# EAGLE design Seaquencer (EAGLE 7.2.0)
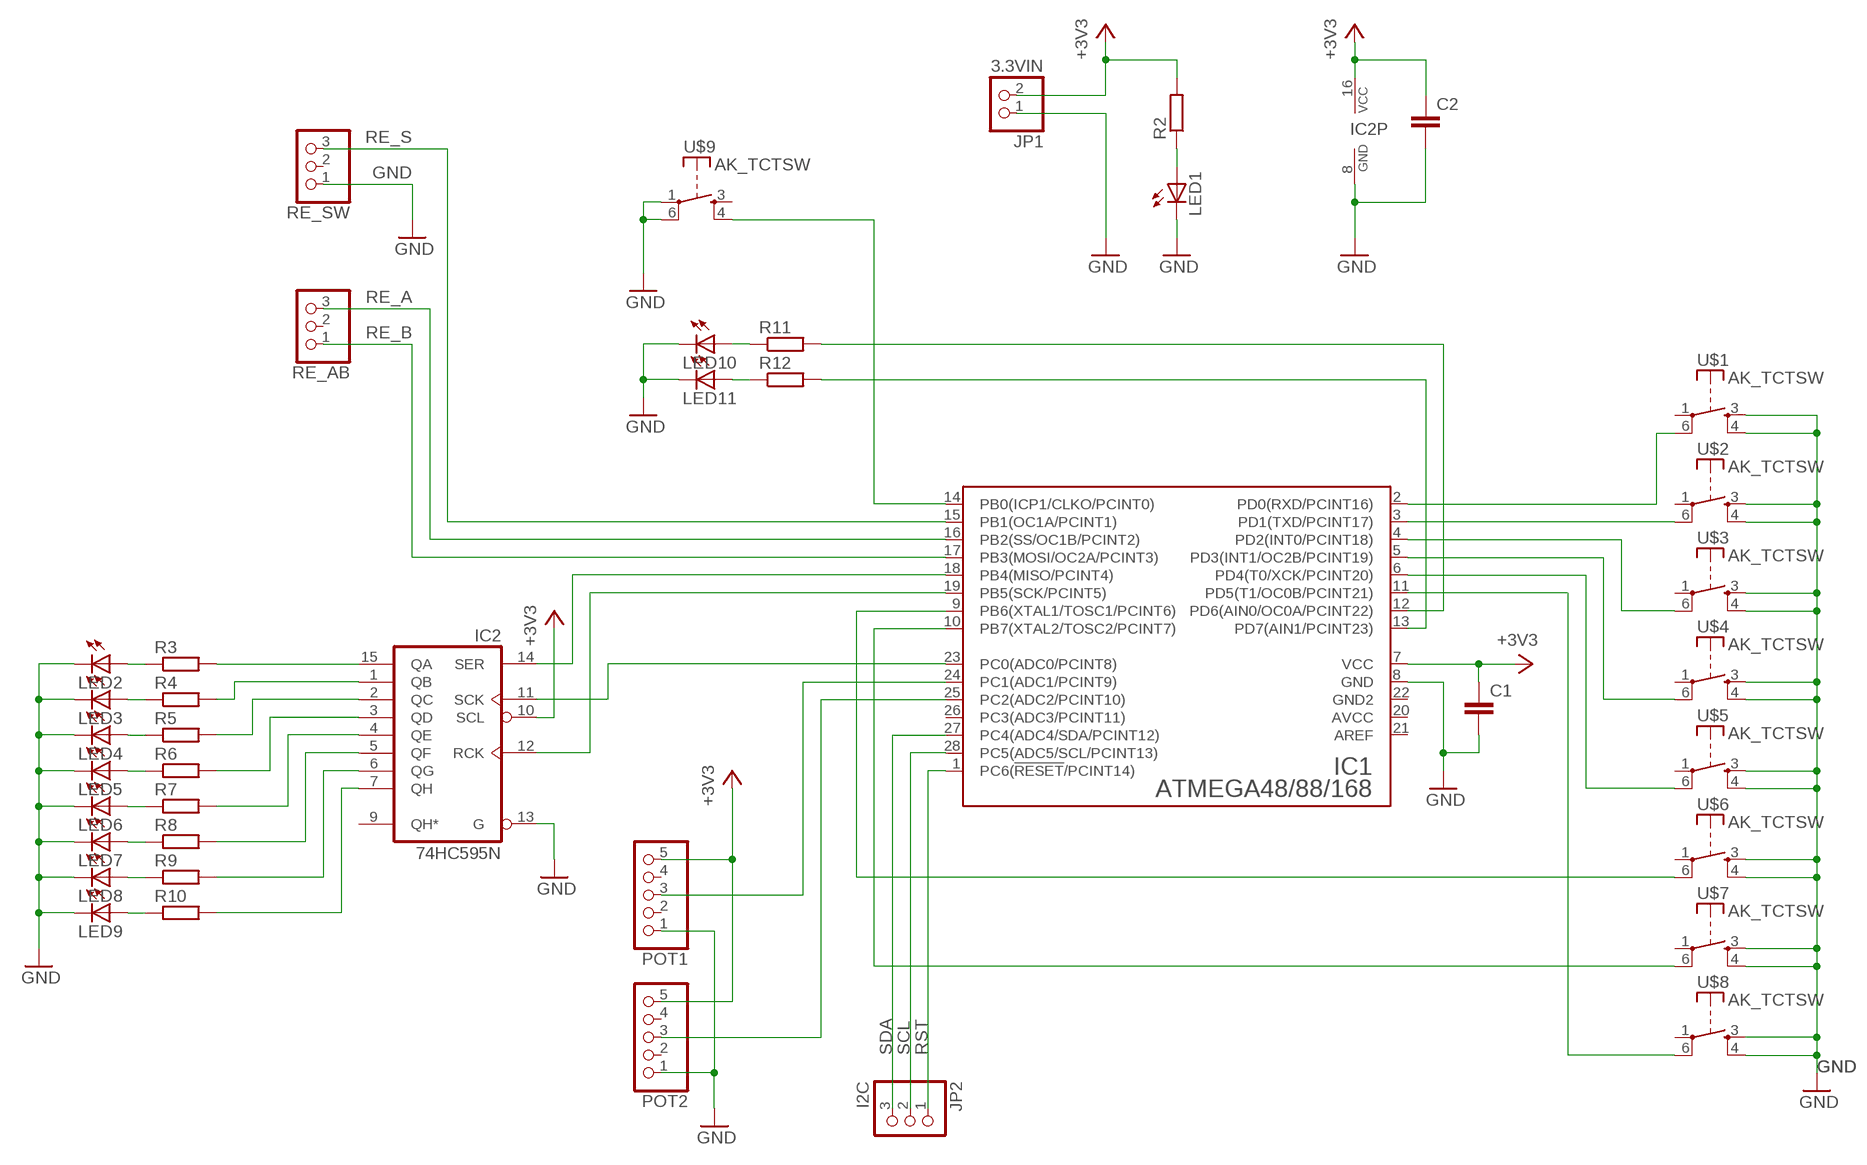
[diagram p0: schematic, sheet 1]

## Parts
C1  C-EU025-024X044  [C025-024X044]
C2  C-EU025-024X044  [C025-024X044]
IC1  ATMEGA48/88/168  [DIL28-3]
IC2  74HC595N  [DIL16]
JP1  3.3VIN  PINHD-1X2  [1X02]
JP2  I2C  PINHD-1X3  [1X03]
LED1  LED3MM  [LED3MM]
LED2  LED3MM  [LED3MM]
LED3  LED3MM  [LED3MM]
LED4  LED3MM  [LED3MM]
LED5  LED3MM  [LED3MM]
LED6  LED3MM  [LED3MM]
LED7  LED3MM  [LED3MM]
LED8  LED3MM  [LED3MM]
LED9  LED3MM  [LED3MM]
LED10  LED3MM  [LED3MM]
LED11  LED3MM  [LED3MM]
POT1  PINHD-1X5  [1X05]
POT2  PINHD-1X5  [1X05]
R2  R-EU_0207/7  [0207/7]
R3  R-EU_0207/7  [0207/7]
R4  R-EU_0207/7  [0207/7]
R5  R-EU_0207/7  [0207/7]
R6  R-EU_0207/7  [0207/7]
R7  R-EU_0207/7  [0207/7]
R8  R-EU_0207/7  [0207/7]
R9  R-EU_0207/7  [0207/7]
R10  R-EU_0207/7  [0207/7]
R11  R-EU_0207/7  [0207/7]
R12  R-EU_0207/7  [0207/7]
RE_AB  PINHD-1X3  [1X03]
RE_SW  PINHD-1X3  [1X03]
U$1  AK_TCTSW  [TME1]
U$2  AK_TCTSW  [TME1]
U$3  AK_TCTSW  [TME1]
U$4  AK_TCTSW  [TME1]
U$5  AK_TCTSW  [TME1]
U$6  AK_TCTSW  [TME1]
U$7  AK_TCTSW  [TME1]
U$8  AK_TCTSW  [TME1]
U$9  AK_TCTSW  [TME1]

## Nets
+3V3: C1.1 C2.1 IC1.7(VCC) IC2.10(SCL) IC2.16(VCC) JP1.2 POT1.5 POT2.5 R2.2
GND: C1.2 C2.2 IC1.8(GND) IC2.8(GND) IC2.13(G) JP1.1 LED1.K(C) LED2.K(C) LED3.K(C) LED4.K(C) LED5.K(C) LED6.K(C) LED7.K(C) LED8.K(C) LED9.K(C) LED10.K(C) LED11.K(C) POT1.1 POT2.1 RE_SW.1 U$1.3(S) U$1.4(S) U$2.3(S) U$2.4(S) U$3.3(S) U$3.4(S) U$4.3(S) U$4.4(S) U$5.3(S) U$5.4(S) U$6.3(S) U$6.4(S) U$7.3(S) U$7.4(S) U$8.3(S) U$8.4(S) U$9.1(P) U$9.6(P)
N$1: IC1.2(PD0(RXD/PCINT16)) U$1.6(P)
N$2: IC1.3(PD1(TXD/PCINT17)) U$2.6(P)
N$3: IC1.11(PD5(T1/OC0B/PCINT21)) U$8.6(P)
N$4: IC1.10(PB7(XTAL2/TOSC2/PCINT7)) U$7.6(P)
N$5: IC1.9(PB6(XTAL1/TOSC1/PCINT6)) U$6.6(P)
N$6: IC1.6(PD4(T0/XCK/PCINT20)) U$5.6(P)
N$7: IC1.5(PD3(INT1/OC2B/PCINT19)) U$4.6(P)
N$8: IC1.18(PB4(MISO/PCINT4)) IC2.14(SER)
N$9: IC1.23(PC0(ADC0/PCINT8)) IC2.11(SCK)
N$10: IC1.24(PC1(ADC1/PCINT9)) POT1.3
N$11: IC1.25(PC2(ADC2/PCINT10)) POT2.3
N$12: IC1.19(PB5(SCK/PCINT5)) IC2.12(RCK)
N$13: IC1.14(PB0(ICP1/CLKO/PCINT0)) U$9.4(S)
N$15: LED1.A R2.1
N$16: IC2.15(QA) R3.2
N$17: IC2.1(QB) R4.2
N$18: IC2.2(QC) R5.2
N$19: IC2.3(QD) R6.2
N$20: IC2.4(QE) R7.2
N$21: IC2.5(QF) R8.2
N$22: IC2.6(QG) R9.2
N$23: IC2.7(QH) R10.2
N$24: LED2.A R3.1
N$25: LED3.A R4.1
N$26: LED4.A R5.1
N$27: LED5.A R6.1
N$28: LED6.A R7.1
N$29: LED7.A R8.1
N$30: LED8.A R9.1
N$31: LED9.A R10.1
N$33: LED11.A R12.1
N$34: LED10.A R11.1
N$35: IC1.13(PD7(AIN1/PCINT23)) R12.2
N$36: IC1.12(PD6(AIN0/OC0A/PCINT22)) R11.2
N$41: IC1.4(PD2(INT0/PCINT18)) U$3.6(P)
RE_A: IC1.16(PB2(SS/OC1B/PCINT2)) RE_AB.3
RE_B: IC1.17(PB3(MOSI/OC2A/PCINT3)) RE_AB.1
RE_S: IC1.15(PB1(OC1A/PCINT1)) RE_SW.3
RST: IC1.1(PC6(!RESET!/PCINT14)) JP2.1
SCL: IC1.28(PC5(ADC5/SCL/PCINT13)) JP2.2
SDA: IC1.27(PC4(ADC4/SDA/PCINT12)) JP2.3
Unconnected: IC1.21(AREF) IC1.26(PC3(ADC3/PCINT11)) IC2.9(QH*) POT1.2 POT1.4 POT2.2 POT2.4 RE_AB.2 RE_SW.2 U$1.1(P) U$2.1(P) U$3.1(P) U$4.1(P) U$5.1(P) U$6.1(P) U$7.1(P) U$8.1(P) U$9.3(S)

## Power pins joined to a net without a drawn wire
AVCC: IC1.20(AVCC)
GND2: IC1.22(GND2)

## Library data of the parts
C1 C2 = rcl:C-EU: CAPACITOR, European symbol
IC1 = mylib:ATMEGA48/88/168
IC2 = 74xx-eu:74*595: 8-bit SHIFT REGISTER, output latch
JP1 = pinhead:PINHD-1X2: PIN HEADER
JP2 RE_AB RE_SW = pinhead:PINHD-1X3: PIN HEADER
LED1-LED11 = led:LED: LED OSRAM: - CHIPLED LG R971, LG N971, LY N971, LG Q971, LY Q971, LO R971, LY R971 LH N974, LH R974 LS Q976, LO Q976, LY Q976 LO Q996 - Hyper CHIPLED LW Q18S LB Q993, LB Q99A, LB R99A - SideLED LS A670, LO A670, LY A670, LG A670, LP A670 LB A673, LV A673, LT A673, LW A673 LH A674 LY A675 LS A676, LA A676, LO A676, LY A676, LW A676 LS A679, LY A679, LG A679 - Hyper Micro SIDELED® LS Y876, LA Y876, LO Y876, LY Y876 LT Y87S - SmartLED LW L88C, LW L88S LB L89C, LB L89S, LG L890 LS L89K, LO L89K, LY L89K LS L896, LA L896, LO L896, LY L896 - TOPLED LS T670, LO T670, LY T670, LG T670, LP T670 LSG T670, LSP T670, LSY T670, LOP T670, LYG T670 LG T671, LOG T671, LSG T671 LB T673, LV T673, LT T673, LW T673 LH T674 LS T676, LA T676, LO T676, LY T676, LB T676, LH T676, LSB T676, LW T676 LB T67C, LV T67C, LT T67C, LS T67K, LO T67K, LY T67K, LW E67C LS E67B, LA E67B, LO E67B, LY E67B, LB E67C, LV E67C, LT E67C LW T67C LS T679, LY T679, LG T679 LS T770, LO T770, LY T770, LG T770, LP T770 LB T773, LV T773, LT T773, LW T773 LH T774 LS E675, LA E675, LY E675, LS T675 LS T776, LA T776, LO T776, LY T776, LB T776 LHGB T686 LT T68C, LB T68C - Hyper Mini TOPLED® LB M676 - Mini TOPLED Santana® LG M470 LS M47K, LO M47K, LY M47K Source: http://www.osram.convergy.de LUXEON: - LUMILED® LXK2-PW12-R00, LXK2-PW12-S00, LXK2-PW14-U00, LXK2-PW14-V00 LXK2-PM12-R00, LXK2-PM12-S00, LXK2-PM14-U00 LXK2-PE12-Q00, LXK2-PE12-R00, LXK2-PE12-S00, LXK2-PE14-T00, LXK2-PE14-U00 LXK2-PB12-K00, LXK2-PB12-L00, LXK2-PB12-M00, LXK2-PB14-N00, LXK2-PB14-P00, LXK2-PB14-Q00 LXK2-PR12-L00, LXK2-PR12-M00, LXK2-PR14-Q00, LXK2-PR14-R00 LXK2-PD12-Q00, LXK2-PD12-R00, LXK2-PD12-S00 LXK2-PH12-R00, LXK2-PH12-S00 LXK2-PL12-P00, LXK2-PL12-Q00, LXK2-PL12-R00 Source: www.luxeon.com KINGBRIGHT: KA-3528ASYC Source: www.kingbright.com
POT1 POT2 = pinhead:PINHD-1X5: PIN HEADER
R2-R12 = rcl:R-EU_: RESISTOR, European symbol
U$1-U$9 = mylib:AK_TCTSW

## Board
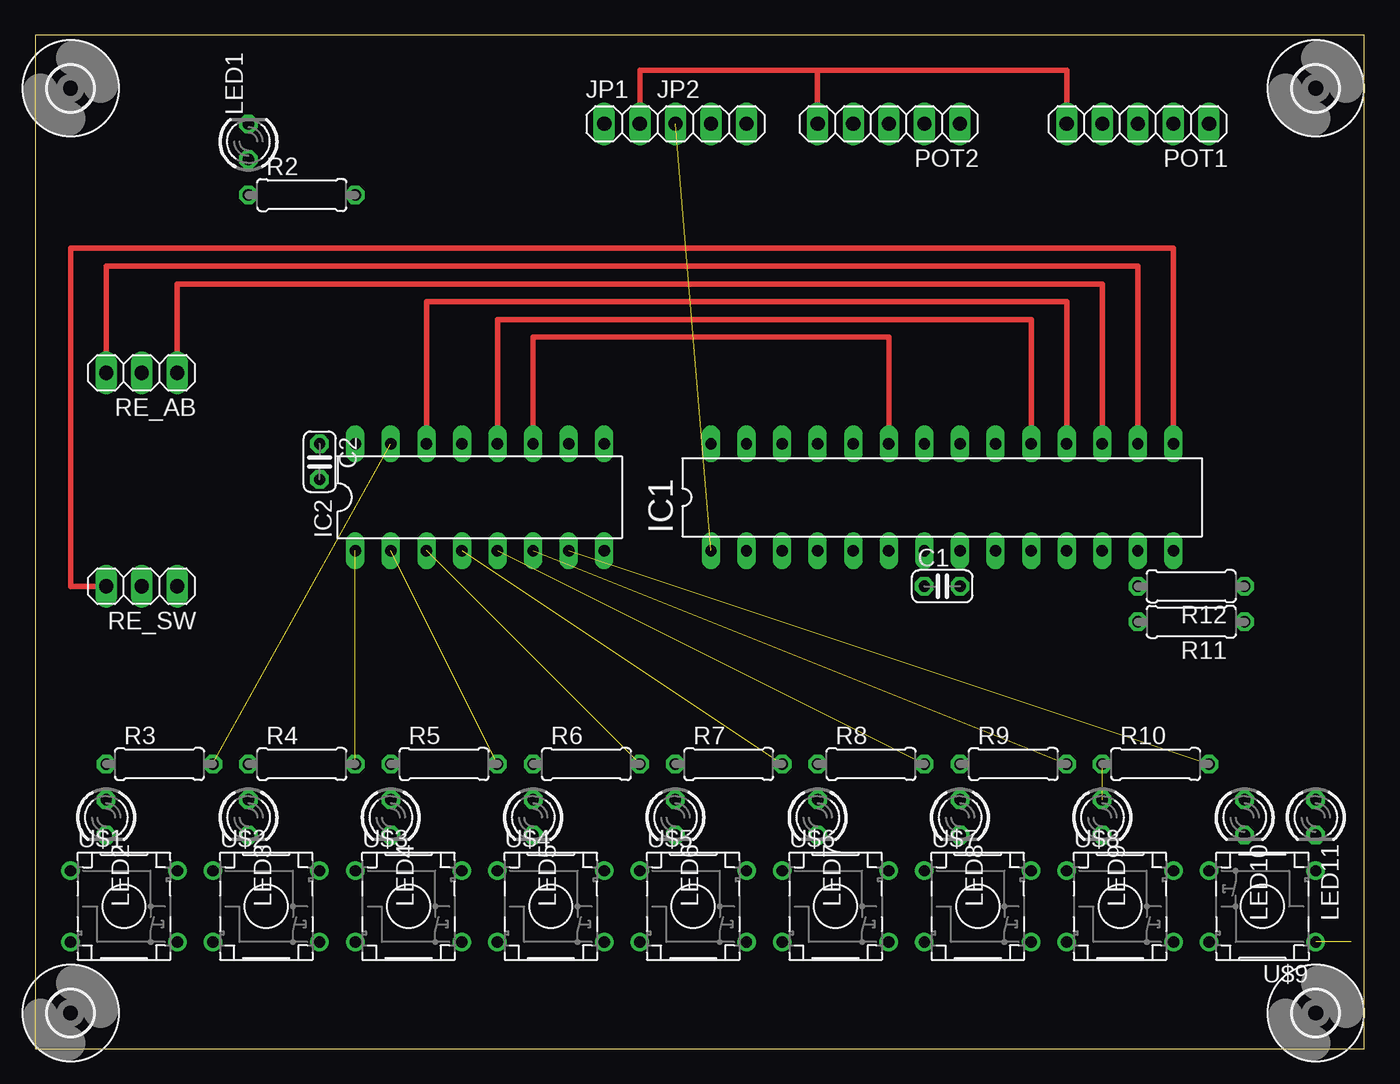
[diagram p1: board, top side]
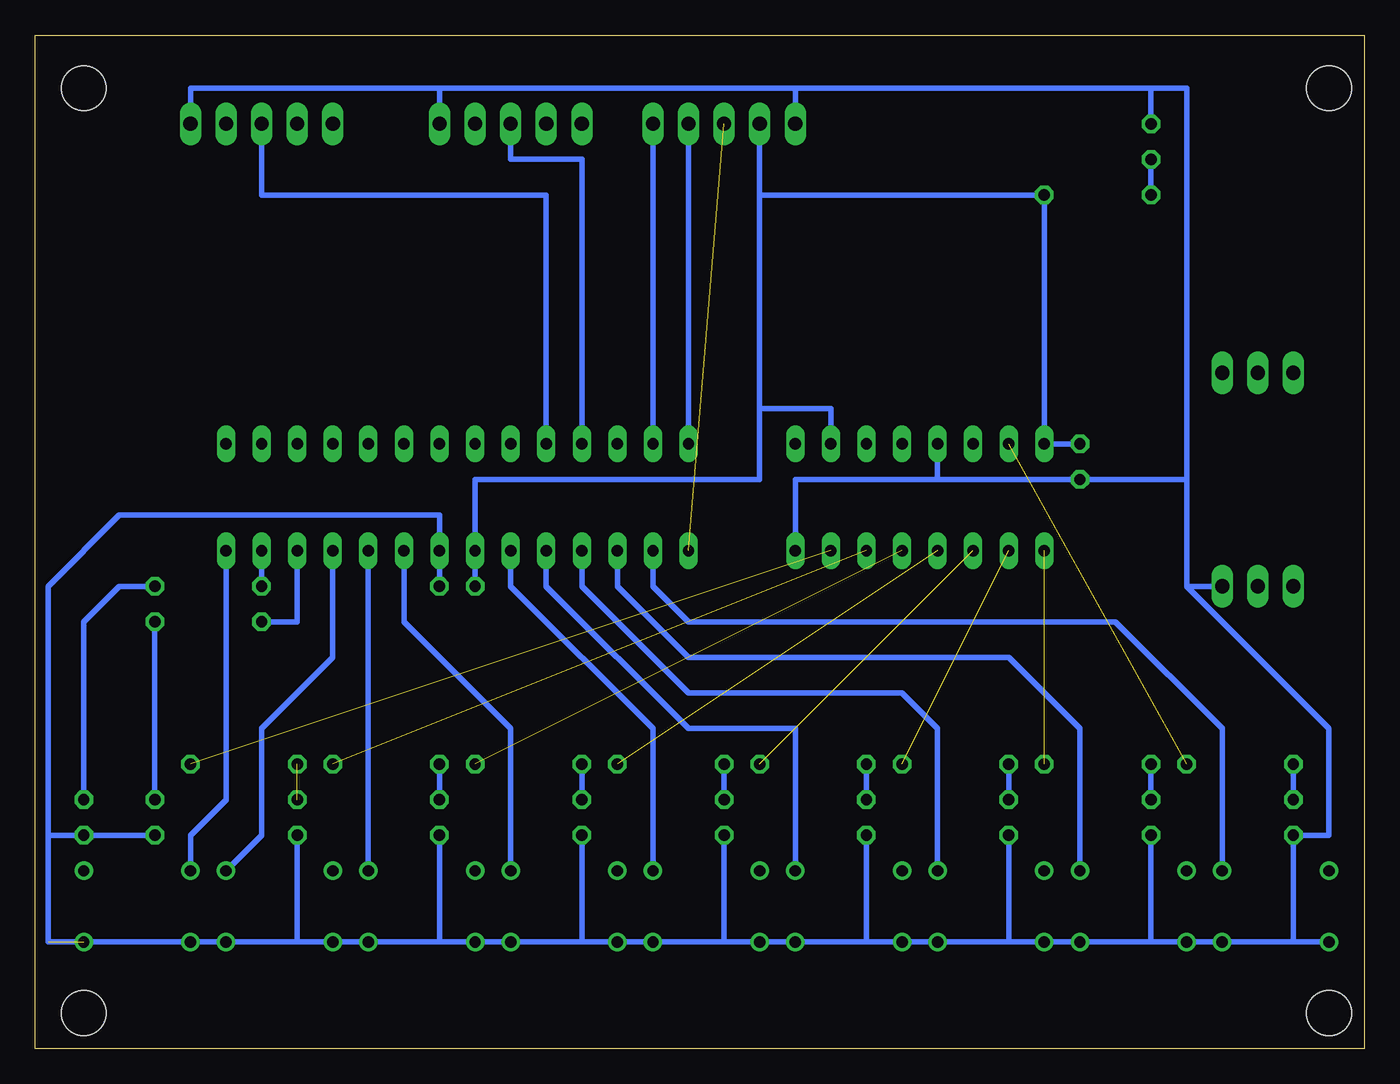
[diagram p2: board, bottom side, seen from below]

Size 94.92 x 72.38 mm. Coordinates in mm from the lower left corner, seen from the top.
Outline: 0,0 94.92,0 94.92,72.38 0,72.38 0,0
Copper layers (1*16): Top 0.035mm / dielectric 1.5mm / Bottom 0.035mm
Design rules "default": minimum track width 10mil, minimum drill 24mil, track to track 8mil, track to pad 8mil, pad to pad 8mil, via to via 8mil, smd to smd 8mil, copper to edge 40mil, drill to drill 8mil, minimum pad ring 10mil, minimum via ring 8mil, stop-mask expansion 4mil, vias tented up to drill 0mil, thermal gap 10mil

### Footprints (pad centres in the part's own frame; a part is rotated, then mirrored left to right if it is on the bottom)
C025-024X044 = drill 0.813 octagon: 1 -1.27,0; 2 1.27,0
DIL28-3 = drill 0.813 long: 1 -15.24,-3.81; 2 -12.7,-3.81; 3 -10.16,-3.81; 4 -7.62,-3.81; 5 -5.08,-3.81; 6 -2.54,-3.81; 7 0,-3.81; 8 2.54,-3.81; 9 5.08,-3.81; 10 7.62,-3.81; 11 10.16,-3.81; 12 12.7,-3.81; 13 15.24,-3.81; 14 17.78,-3.81; 15 17.78,3.81; 16 15.24,3.81; 17 12.7,3.81; 18 10.16,3.81; 19 7.62,3.81; 20 5.08,3.81; 21 2.54,3.81; 22 0,3.81; 23 -2.54,3.81; 24 -5.08,3.81; 25 -7.62,3.81; 26 -10.16,3.81; 27 -12.7,3.81; 28 -15.24,3.81
DIL16 = drill 0.813 long: 1 -8.89,-3.81; 2 -6.35,-3.81; 3 -3.81,-3.81; 4 -1.27,-3.81; 5 1.27,-3.81; 6 3.81,-3.81; 7 6.35,-3.81; 8 8.89,-3.81; 9 8.89,3.81; 10 6.35,3.81; 11 3.81,3.81; 12 1.27,3.81; 13 -1.27,3.81; 14 -3.81,3.81; 15 -6.35,3.81; 16 -8.89,3.81
1X02 = drill 1.016 long: 1 -1.27,0; 2 1.27,0
1X03 = drill 1.016 long: 1 -2.54,0; 2 0,0; 3 2.54,0
LED3MM = drill 0.813 octagon: A -1.27,0; K 1.27,0
1X05 = drill 1.016 long: 1 -5.08,0; 2 -2.54,0; 3 0,0; 4 2.54,0; 5 5.08,0
0207/7 = drill 0.813 octagon: 1 -3.81,0; 2 3.81,0
TME1 = drill 0.813: 1 -2.54,-3.81; 3 2.54,-3.81; 4 2.54,3.81; 6 -2.54,3.81
3,2 = hole 3.2: 0,0

### Placement (x,y rotation side)
C1  64.77,33.02 0 top
C2  20.32,41.91 270 top
IC1  63.5,39.37 0 top
IC2  31.75,39.37 0 top
JP1  41.91,66.04 0 top
JP2  48.26,66.04 0 top
LED1  15.24,64.77 90 top
LED2  5.08,16.51 270 top
LED3  15.24,16.51 270 top
LED4  25.4,16.51 270 top
LED5  35.56,16.51 270 top
LED6  45.72,16.51 270 top
LED7  55.88,16.51 270 top
LED8  66.04,16.51 270 top
LED9  76.2,16.51 270 top
LED10  86.36,16.51 270 top
LED11  91.44,16.51 270 top
POT1  78.74,66.04 180 top
POT2  60.96,66.04 180 top
R2  19.05,60.96 0 top
R3  8.89,20.32 0 top
R4  19.05,20.32 0 top
R5  29.21,20.32 0 top
R6  39.37,20.32 0 top
R7  49.53,20.32 0 top
R8  59.69,20.32 0 top
R9  69.85,20.32 0 top
R10  80.01,20.32 0 top
R11  82.55,30.48 180 top
R12  82.55,33.02 180 top
RE_AB  7.62,48.26 180 top
RE_SW  7.62,33.02 180 top
U$1  6.35,10.16 270 top
U$2  16.51,10.16 270 top
U$3  26.67,10.16 270 top
U$4  36.83,10.16 270 top
U$5  46.99,10.16 270 top
U$6  57.15,10.16 270 top
U$7  67.31,10.16 270 top
U$8  77.47,10.16 270 top
U$9  87.63,10.16 90 top
U$10  [3,2]  2.54,2.54 0 top
U$11  [3,2]  91.44,2.54 0 top
U$12  [3,2]  2.54,68.58 0 top
U$13  [3,2]  91.44,68.58 0 top

### Tracks (layer width: path | path; a pad name or v marks a point on that pad's centre or on a via)
+3V3
  Top 0.406: JP1.2 43.18,69.85 55.88,69.85 | 55.88,69.85 73.66,69.85 POT1.5 | POT2.5 55.88,69.85
  Bottom 0.406: C2.1 IC2.16 R2.2 43.18,60.96 | C1.1 IC1.7 63.5,40.64 43.18,40.64 43.18,45.72 | JP1.2 43.18,60.96 | 43.18,60.96 43.18,45.72 | IC2.10 38.1,45.72 43.18,45.72
GND  (1 unrouted)
  Bottom 0.406: 5.08,7.62 LED2.K 2.54,15.24 2.54,22.86 12.7,33.02 | 5.08,7.62 U$1.3 | 5.08,7.62 U$1.4 U$2.3 15.24,7.62 | 15.24,7.62 U$2.4 U$3.3 25.4,7.62 | 25.4,7.62 U$3.4 U$4.3 35.56,7.62 | 35.56,7.62 U$4.4 U$5.3 45.72,7.62 | 45.72,7.62 U$5.4 U$6.3 55.88,7.62 | 55.88,7.62 U$6.4 U$7.3 66.04,7.62 | 66.04,7.62 U$7.4 U$8.3 76.2,7.62 | 76.2,7.62 U$8.4 U$9.6 93.98,7.62 93.98,15.24 | LED3.K 15.24,7.62 | LED4.K 25.4,7.62 | LED5.K 35.56,7.62 | LED6.K 45.72,7.62 | LED7.K 55.88,7.62 | LED8.K 66.04,7.62 | LED9.K 76.2,7.62 | LED10.K LED11.K 93.98,15.24 | IC2.8 40.64,40.64 30.48,40.64 | IC1.8 C1.2 66.04,38.1 88.9,38.1 93.98,33.02 93.98,15.24 | 12.7,40.64 C2.2 30.48,40.64 | 12.7,40.64 12.7,68.58 15.24,68.58 | 12.7,33.02 12.7,40.64 | 30.48,40.64 IC2.13 | RE_SW.1 12.7,33.02 | 15.24,68.58 40.64,68.58 | LED1.K 15.24,68.58 | JP1.1 40.64,68.58 | 40.64,68.58 66.04,68.58 | 66.04,68.58 83.82,68.58 POT1.1 | POT2.1 66.04,68.58
N$1
  Bottom 0.406: U$1.6 10.16,22.86 17.78,30.48 48.26,30.48 50.8,33.02 IC1.2
N$2
  Bottom 0.406: U$2.6 20.32,22.86 25.4,27.94 48.26,27.94 53.34,33.02 IC1.3
N$3
  Bottom 0.406: IC1.11 73.66,27.94 78.74,22.86 78.74,15.24 U$8.6
N$4
  Bottom 0.406: IC1.10 U$7.6
N$5
  Bottom 0.406: U$6.6 60.96,22.86 68.58,30.48 IC1.9
N$6
  Bottom 0.406: U$5.6 50.8,22.86 60.96,33.02 IC1.6
N$7
  Bottom 0.406: U$4.6 40.64,22.86 48.26,22.86 58.42,33.02 IC1.5
N$8
  Top 0.406: IC1.18 73.66,53.34 27.94,53.34 IC2.14
N$9
  Top 0.406: IC1.23 60.96,50.8 35.56,50.8 IC2.11
N$10
  Bottom 0.406: IC1.24 58.42,60.96 78.74,60.96 POT1.3
N$11
  Bottom 0.406: IC1.25 55.88,63.5 60.96,63.5 POT2.3
N$12
  Top 0.406: IC2.12 33.02,52.07 71.12,52.07 IC1.19
N$13
  Bottom 0.406: U$9.4 83.82,15.24 81.28,17.78 IC1.14
N$15
  Bottom 0.406: R2.1 LED1.A
N$16  (1 unrouted)
N$17  (1 unrouted)
N$18  (1 unrouted)
N$19  (1 unrouted)
N$20  (1 unrouted)
N$21  (1 unrouted)
N$22  (1 unrouted)
N$23  (1 unrouted)
N$24
  Bottom 0.406: R3.1 LED2.A
N$25
  Bottom 0.406: R4.1 LED3.A
N$26
  Bottom 0.406: R5.1 LED4.A
N$27
  Bottom 0.406: R6.1 LED5.A
N$28
  Bottom 0.406: R7.1 LED6.A
N$29
  Bottom 0.406: R8.1 LED7.A
N$30
  Bottom 0.406: R9.1 LED8.A
N$31  (1 unrouted)
N$33
  Bottom 0.406: LED11.A 91.44,30.48 88.9,33.02 R12.1
N$34
  Bottom 0.406: R11.1 LED10.A
N$35
  Bottom 0.406: IC1.13 R12.2
N$36
  Bottom 0.406: IC1.12 76.2,30.48 R11.2
N$41
  Bottom 0.406: U$3.6 30.48,22.86 33.02,25.4 48.26,25.4 55.88,33.02 IC1.4
RE_A
  Top 0.406: RE_AB.3 5.08,55.88 78.74,55.88 IC1.16
RE_B
  Top 0.406: RE_AB.1 10.16,54.61 76.2,54.61 IC1.17
RE_S
  Top 0.406: RE_SW.3 2.54,33.02 2.54,57.15 81.28,57.15 IC1.15
RST  (1 unrouted)
SCL
  Bottom 0.406: JP2.2 IC1.28
SDA
  Bottom 0.406: IC1.27 JP2.3